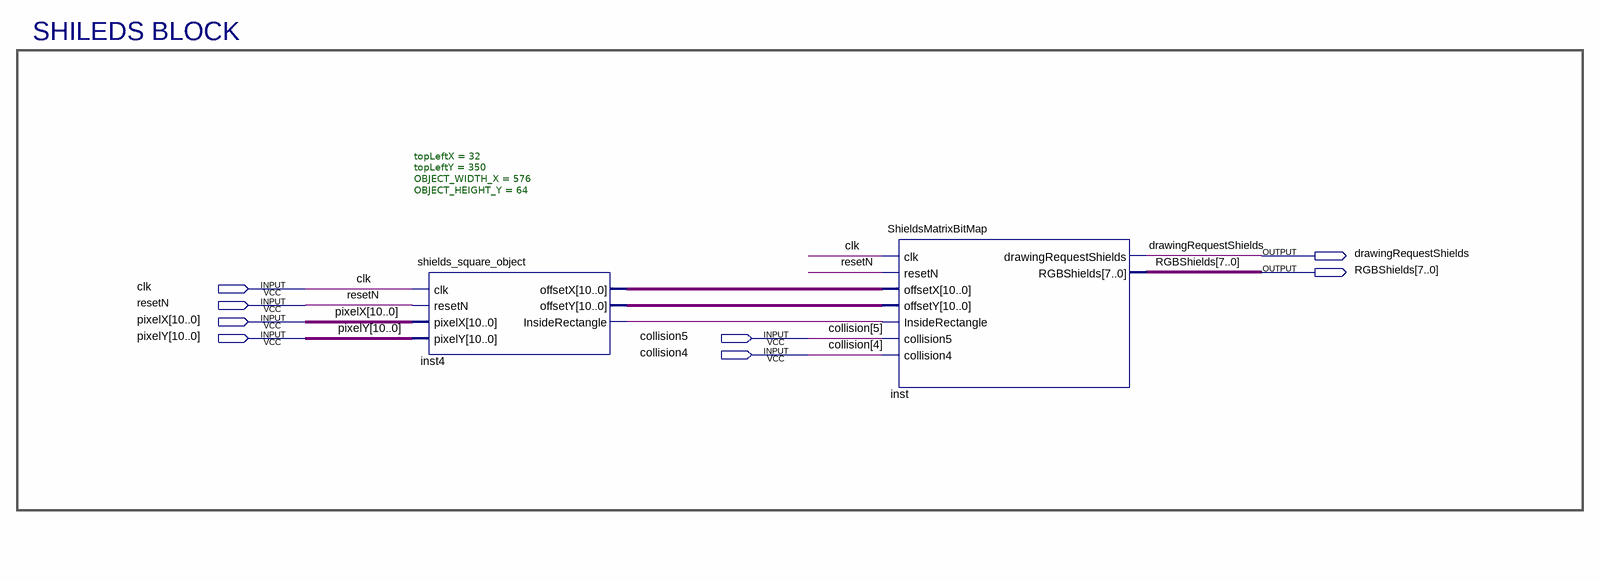
[diagram p0: schematic sheet]
// Quartus schematic SHIELDS_DISPLAY.bdf as structural Verilog: 2 symbols, 8 pins
module SHIELDS_DISPLAY (
  input  clk,
  input  resetN,
  input  [10:0] pixelX,
  input  [10:0] pixelY,
  input  collision5,
  input  collision4,
  output drawingRequestShields,
  output [7:0] RGBShields
);

  wire inst4_insiderectangle;
  wire [10:0] inst4_offsetx, inst4_offsety;

  shields_square_object #(.topLeftX(32), .topLeftY(350), .OBJECT_WIDTH_X(576), .OBJECT_HEIGHT_Y(64)) inst4 (
    .clk(clk), .resetN(resetN), .pixelX(pixelX), .pixelY(pixelY), .offsetX(inst4_offsetx),
    .offsetY(inst4_offsety), .InsideRectangle(inst4_insiderectangle));
  ShieldsMatrixBitMap inst (
    .clk(clk), .resetN(resetN), .offsetX(inst4_offsetx), .offsetY(inst4_offsety),
    .InsideRectangle(inst4_insiderectangle), .collision5(collision5), .collision4(collision4),
    .drawingRequestShields(drawingRequestShields), .RGBShields(RGBShields));

  // Notes on the sheet:
  //   SHILEDS BLOCK
endmodule
